# Altium project CoreHardware_2024.9.28.PrjPcb
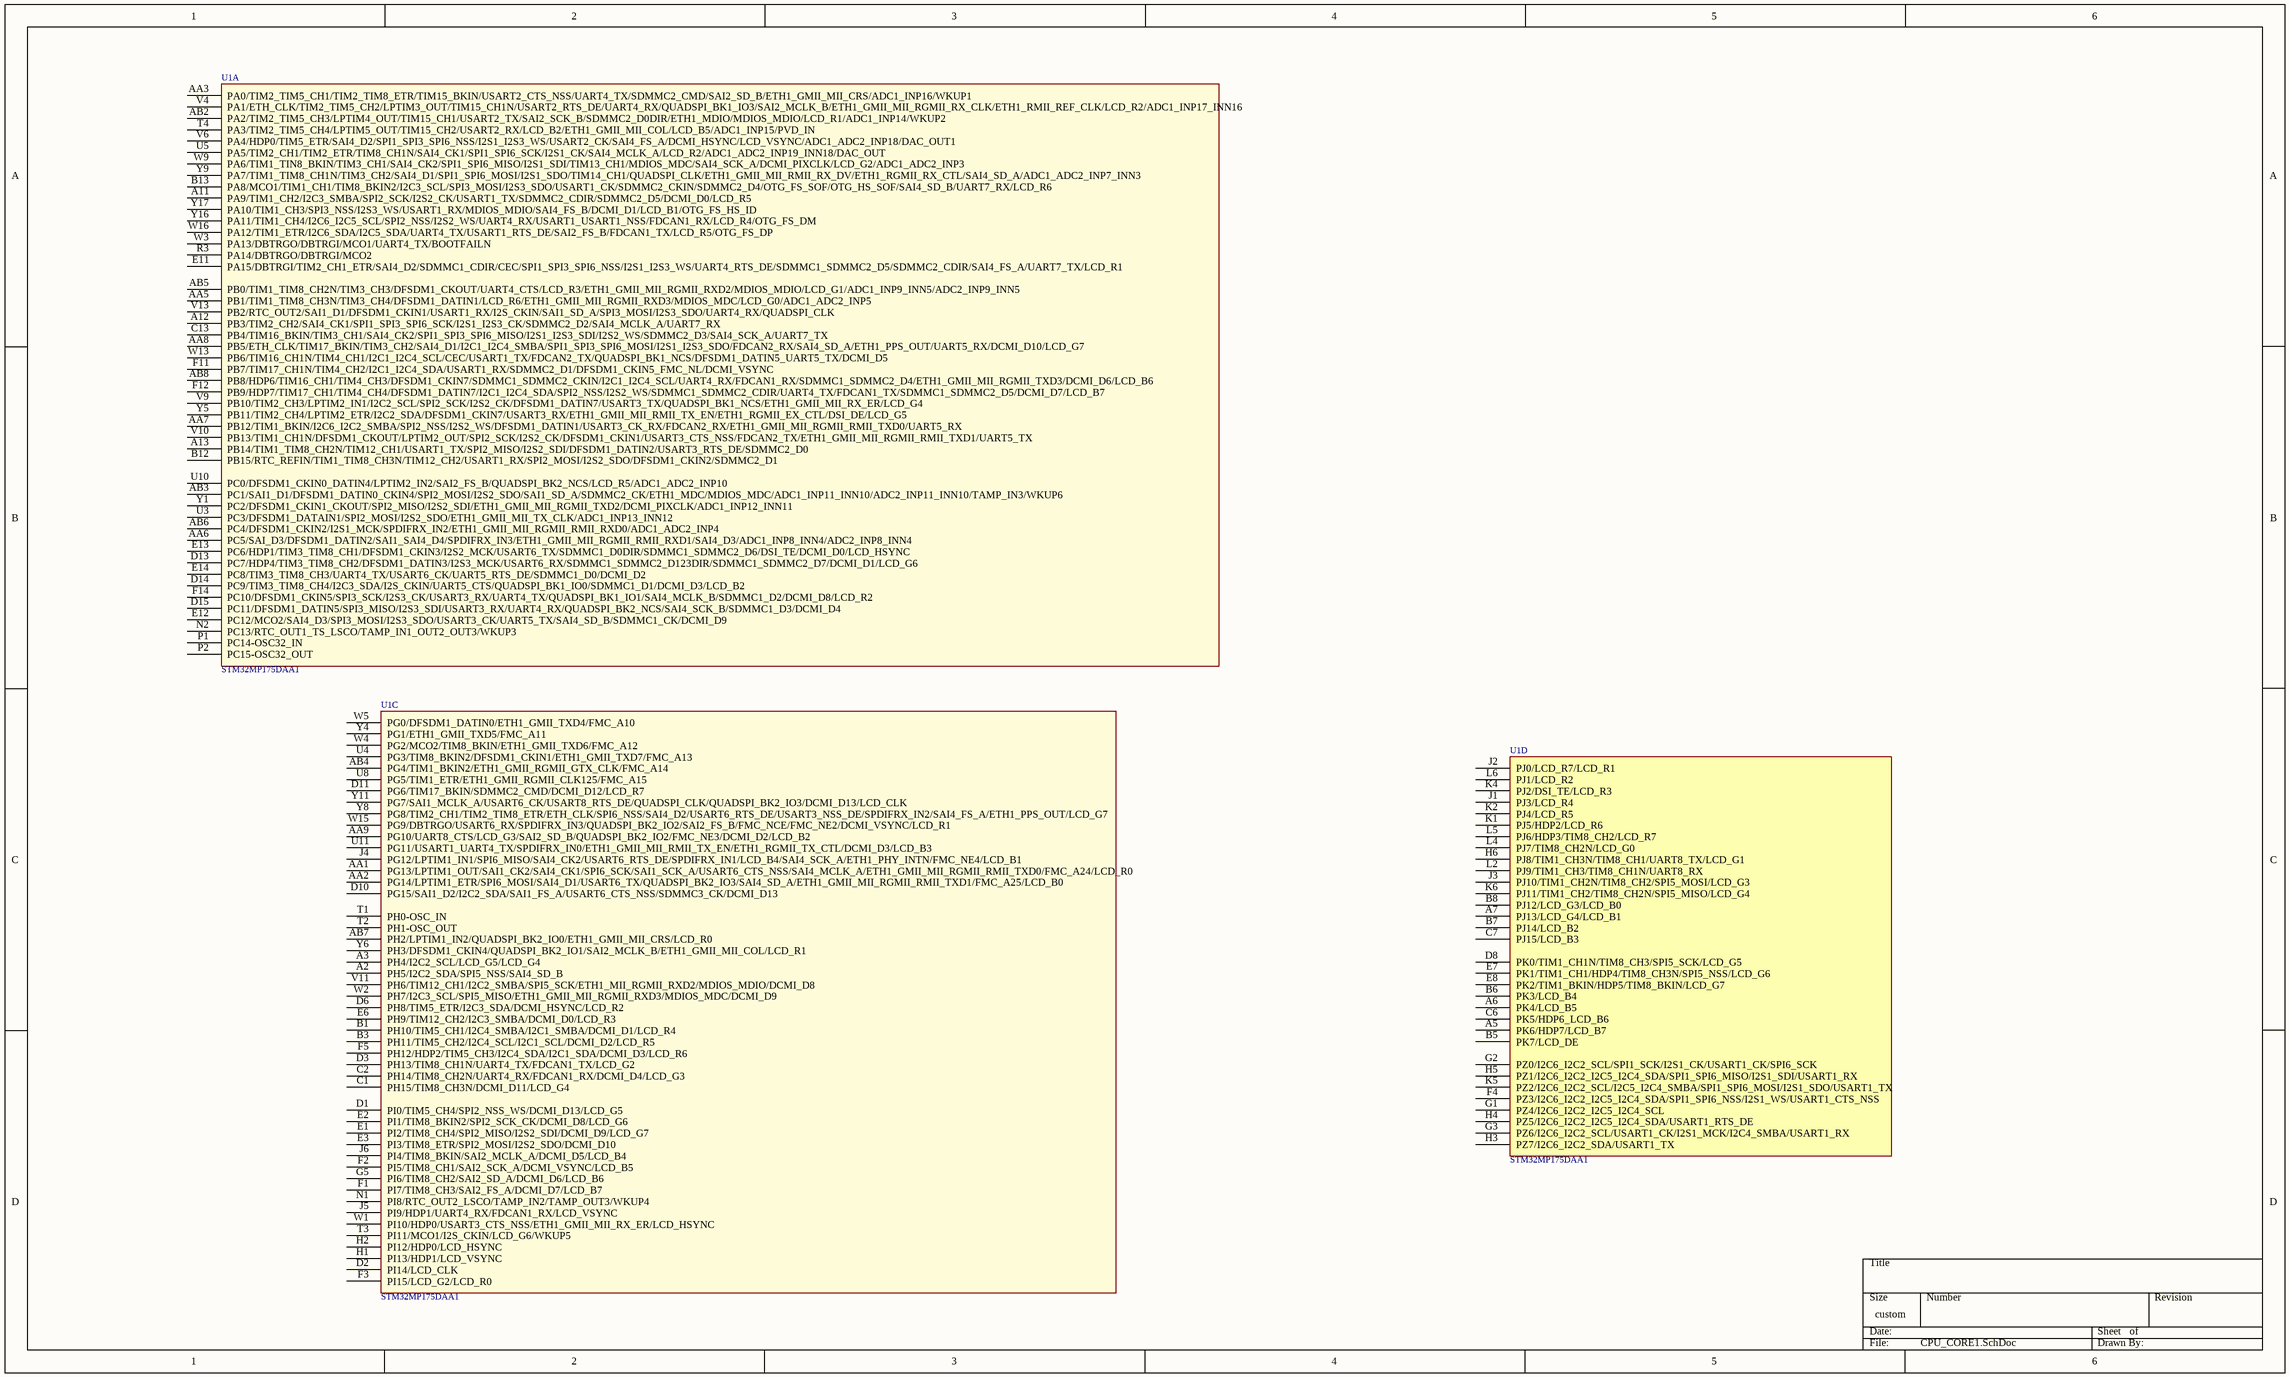
[diagram p0: CPU_CORE1.SchDoc]
9 sheets, 84 parts. Net scope: global (net labels, ports and power ports of the same name join across sheets).
Board file: CoreSTM32MP157.PcbDoc
Sheets:
  CPU_CORE1.SchDoc
  CPU_CORE2.SchDoc
  CPU_DDR.SchDoc
  CPU_POWER.SchDoc
  POWER.SchDoc
  DDR.SchDoc
  EMMC.SchDoc
  PHY.SchDoc
  BTB.SchDoc

## Sheet CPU_CORE1.SchDoc
size 508 x 304 mm; SheetNumber: 1; SheetTotal: 6

### Parts
(Parts that share a designator on the sheet are numbered #1, #2 ... from top to bottom, then left to right.)
U1#1  STM32MP175DAA1  [LFBGA448]  (parts A,C,D of 7)

### Nets

Not connected (* = marked no-connect by the designer): U1#1 A2(PH5/I2C2_SDA/SPI5_NSS/SAI4_SD_B) A3(PH4/I2C2_SCL/LCD_G5/LCD_G4) A5(PK6/HDP7/LCD_B7) A6(PK4/LCD_B5) A7(PJ13/LCD_G4/LCD_B1) A11(PA9/TIM1_CH2/I2C3_SMBA/SPI2_SCK/I2S2_CK/USART1_TX/SDMMC2_CDIR/SDMMC2_D5/DCMI_D0/LCD_R5) A12(PB3/TIM2_CH2/SAI4_CK1/SPI1_SPI3_SPI6_SCK/I2S1_I2S3_CK/SDMMC2_D2/SAI4_MCLK_A/UART7_RX) A13(PB14/TIM1_TIM8_CH2N/TIM12_CH1/USART1_TX/SPI2_MISO/I2S2_SDI/DFSDM1_DATIN2/USART3_RTS_DE/SDMMC2_D0) AA1(PG13/LPTIM1_OUT/SAI1_CK2/SAI4_CK1/SPI6_SCK/SAI1_SCK_A/USART6_CTS_NSS/SAI4_MCLK_A/ETH1_GMII_MII_RGMII_RMII_TXD0/FMC_A24/LCD_R0) AA2(PG14/LPTIM1_ETR/SPI6_MOSI/SAI4_D1/USART6_TX/QUADSPI_BK2_IO3/SAI4_SD_A/ETH1_GMII_MII_RGMII_RMII_TXD1/FMC_A25/LCD_B0) AA3(PA0/TIM2_TIM5_CH1/TIM2_TIM8_ETR/TIM15_BKIN/USART2_CTS_NSS/UART4_TX/SDMMC2_CMD/SAI2_SD_B/ETH1_GMII_MII_CRS/ADC1_INP16/WKUP1) AA5(PB1/TIM1_TIM8_CH3N/TIM3_CH4/DFSDM1_DATIN1/LCD_R6/ETH1_GMII_MII_RGMII_RXD3/MDIOS_MDC/LCD_G0/ADC1_ADC2_INP5) AA6(PC5/SAI_D3/DFSDM1_DATIN2/SAI1_SAI4_D4/SPDIFRX_IN3/ETH1_GMII_MII_RGMII_RMII_RXD1/SAI4_D3/ADC1_INP8_INN4/ADC2_INP8_INN4) AA7(PB12/TIM1_BKIN/I2C6_I2C2_SMBA/SPI2_NSS/I2S2_WS/DFSDM1_DATIN1/USART3_CK_RX/FDCAN2_RX/ETH1_GMII_MII_RGMII_RMII_TXD0/UART5_RX) AA8(PB5/ETH_CLK/TIM17_BKIN/TIM3_CH2/SAI4_D1/I2C1_I2C4_SMBA/SPI1_SPI3_SPI6_MOSI/I2S1_I2S3_SDO/FDCAN2_RX/SAI4_SD_A/ETH1_PPS_OUT/UART5_RX/DCMI_D10/LCD_G7) AA9(PG10/UART8_CTS/LCD_G3/SAI2_SD_B/QUADSPI_BK2_IO2/FMC_NE3/DCMI_D2/LCD_B2) AB2(PA2/TIM2_TIM5_CH3/LPTIM4_OUT/TIM15_CH1/USART2_TX/SAI2_SCK_B/SDMMC2_D0DIR/ETH1_MDIO/MDIOS_MDIO/LCD_R1/ADC1_INP14/WKUP2) AB3(PC1/SAI1_D1/DFSDM1_DATIN0_CKIN4/SPI2_MOSI/I2S2_SDO/SAI1_SD_A/SDMMC2_CK/ETH1_MDC/MDIOS_MDC/ADC1_INP11_INN10/ADC2_INP11_INN10/TAMP_IN3/WKUP6) AB4(PG4/TIM1_BKIN2/ETH1_GMII_RGMII_GTX_CLK/FMC_A14) AB5(PB0/TIM1_TIM8_CH2N/TIM3_CH3/DFSDM1_CKOUT/UART4_CTS/LCD_R3/ETH1_GMII_MII_RGMII_RXD2/MDIOS_MDIO/LCD_G1/ADC1_INP9_INN5/ADC2_INP9_INN5) AB6(PC4/DFSDM1_CKIN2/I2S1_MCK/SPDIFRX_IN2/ETH1_GMII_MII_RGMII_RMII_RXD0/ADC1_ADC2_INP4) AB7(PH2/LPTIM1_IN2/QUADSPI_BK2_IO0/ETH1_GMII_MII_CRS/LCD_R0) AB8(PB8/HDP6/TIM16_CH1/TIM4_CH3/DFSDM1_CKIN7/SDMMC1_SDMMC2_CKIN/I2C1_I2C4_SCL/UART4_RX/FDCAN1_RX/SDMMC1_SDMMC2_D4/ETH1_GMII_MII_RGMII_TXD3/DCMI_D6/LCD_B6) B1(PH10/TIM5_CH1/I2C4_SMBA/I2C1_SMBA/DCMI_D1/LCD_R4) B3(PH11/TIM5_CH2/I2C4_SCL/I2C1_SCL/DCMI_D2/LCD_R5) B5(PK7/LCD_DE) B6(PK3/LCD_B4) B7(PJ14/LCD_B2) B8(PJ12/LCD_G3/LCD_B0) B12(PB15/RTC_REFIN/TIM1_TIM8_CH3N/TIM12_CH2/USART1_RX/SPI2_MOSI/I2S2_SDO/DFSDM1_CKIN2/SDMMC2_D1) B13(PA8/MCO1/TIM1_CH1/TIM8_BKIN2/I2C3_SCL/SPI3_MOSI/I2S3_SDO/USART1_CK/SDMMC2_CKIN/SDMMC2_D4/OTG_FS_SOF/OTG_HS_SOF/SAI4_SD_B/UART7_RX/LCD_R6) C1(PH15/TIM8_CH3N/DCMI_D11/LCD_G4) C2(PH14/TIM8_CH2N/UART4_RX/FDCAN1_RX/DCMI_D4/LCD_G3) C6(PK5/HDP6_LCD_B6) C7(PJ15/LCD_B3) C13(PB4/TIM16_BKIN/TIM3_CH1/SAI4_CK2/SPI1_SPI3_SPI6_MISO/I2S1_I2S3_SDI/I2S2_WS/SDMMC2_D3/SAI4_SCK_A/UART7_TX) D1(PI0/TIM5_CH4/SPI2_NSS_WS/DCMI_D13/LCD_G5) D2(PI14/LCD_CLK) D3(PH13/TIM8_CH1N/UART4_TX/FDCAN1_TX/LCD_G2) D6(PH8/TIM5_ETR/I2C3_SDA/DCMI_HSYNC/LCD_R2) D8(PK0/TIM1_CH1N/TIM8_CH3/SPI5_SCK/LCD_G5) D10(PG15/SAI1_D2/I2C2_SDA/SAI1_FS_A/USART6_CTS_NSS/SDMMC3_CK/DCMI_D13) D11(PG6/TIM17_BKIN/SDMMC2_CMD/DCMI_D12/LCD_R7) D13(PC7/HDP4/TIM3_TIM8_CH2/DFSDM1_DATIN3/I2S3_MCK/USART6_RX/SDMMC1_SDMMC2_D123DIR/SDMMC1_SDMMC2_D7/DCMI_D1/LCD_G6) D14(PC9/TIM3_TIM8_CH4/I2C3_SDA/I2S_CKIN/UART5_CTS/QUADSPI_BK1_IO0/SDMMC1_D1/DCMI_D3/LCD_B2) D15(PC11/DFSDM1_DATIN5/SPI3_MISO/I2S3_SDI/USART3_RX/UART4_RX/QUADSPI_BK2_NCS/SAI4_SCK_B/SDMMC1_D3/DCMI_D4) E1(PI2/TIM8_CH4/SPI2_MISO/I2S2_SDI/DCMI_D9/LCD_G7) E2(PI1/TIM8_BKIN2/SPI2_SCK_CK/DCMI_D8/LCD_G6) E3(PI3/TIM8_ETR/SPI2_MOSI/I2S2_SDO/DCMI_D10) E6(PH9/TIM12_CH2/I2C3_SMBA/DCMI_D0/LCD_R3) E7(PK1/TIM1_CH1/HDP4/TIM8_CH3N/SPI5_NSS/LCD_G6) E8(PK2/TIM1_BKIN/HDP5/TIM8_BKIN/LCD_G7) E11(PA15/DBTRGI/TIM2_CH1_ETR/SAI4_D2/SDMMC1_CDIR/CEC/SPI1_SPI3_SPI6_NSS/I2S1_I2S3_WS/UART4_RTS_DE/SDMMC1_SDMMC2_D5/SDMMC2_CDIR/SAI4_FS_A/UART7_TX/LCD_R1) E12(PC12/MCO2/SAI4_D3/SPI3_MOSI/I2S3_SDO/USART3_CK/UART5_TX/SAI4_SD_B/SDMMC1_CK/DCMI_D9) E13(PC6/HDP1/TIM3_TIM8_CH1/DFSDM1_CKIN3/I2S2_MCK/USART6_TX/SDMMC1_D0DIR/SDMMC1_SDMMC2_D6/DSI_TE/DCMI_D0/LCD_HSYNC) E14(PC8/TIM3_TIM8_CH3/UART4_TX/USART6_CK/UART5_RTS_DE/SDMMC1_D0/DCMI_D2) F1(PI7/TIM8_CH3/SAI2_FS_A/DCMI_D7/LCD_B7) F2(PI5/TIM8_CH1/SAI2_SCK_A/DCMI_VSYNC/LCD_B5) F3(PI15/LCD_G2/LCD_R0) F4(PZ3/I2C6_I2C2_I2C5_I2C4_SDA/SPI1_SPI6_NSS/I2S1_WS/USART1_CTS_NSS) F5(PH12/HDP2/TIM5_CH3/I2C4_SDA/I2C1_SDA/DCMI_D3/LCD_R6) F11(PB7/TIM17_CH1N/TIM4_CH2/I2C1_I2C4_SDA/USART1_RX/SDMMC2_D1/DFSDM1_CKIN5_FMC_NL/DCMI_VSYNC) F12(PB9/HDP7/TIM17_CH1/TIM4_CH4/DFSDM1_DATIN7/I2C1_I2C4_SDA/SPI2_NSS/I2S2_WS/SDMMC1_SDMMC2_CDIR/UART4_TX/FDCAN1_TX/SDMMC1_SDMMC2_D5/DCMI_D7/LCD_B7) F14(PC10/DFSDM1_CKIN5/SPI3_SCK/I2S3_CK/USART3_RX/UART4_TX/QUADSPI_BK1_IO1/SAI4_MCLK_B/SDMMC1_D2/DCMI_D8/LCD_R2) G1(PZ4/I2C6_I2C2_I2C5_I2C4_SCL) G2(PZ0/I2C6_I2C2_SCL/SPI1_SCK/I2S1_CK/USART1_CK/SPI6_SCK) G3(PZ6/I2C6_I2C2_SCL/USART1_CK/I2S1_MCK/I2C4_SMBA/USART1_RX) G5(PI6/TIM8_CH2/SAI2_SD_A/DCMI_D6/LCD_B6) H1(PI13/HDP1/LCD_VSYNC) H2(PI12/HDP0/LCD_HSYNC) H3(PZ7/I2C6_I2C2_SDA/USART1_TX) H4(PZ5/I2C6_I2C2_I2C5_I2C4_SDA/USART1_RTS_DE) H5(PZ1/I2C6_I2C2_I2C5_I2C4_SDA/SPI1_SPI6_MISO/I2S1_SDI/USART1_RX) H6(PJ8/TIM1_CH3N/TIM8_CH1/UART8_TX/LCD_G1) J1(PJ3/LCD_R4) J2(PJ0/LCD_R7/LCD_R1) J3(PJ10/TIM1_CH2N/TIM8_CH2/SPI5_MOSI/LCD_G3) J4(PG12/LPTIM1_IN1/SPI6_MISO/SAI4_CK2/USART6_RTS_DE/SPDIFRX_IN1/LCD_B4/SAI4_SCK_A/ETH1_PHY_INTN/FMC_NE4/LCD_B1) J5(PI9/HDP1/UART4_RX/FDCAN1_RX/LCD_VSYNC) J6(PI4/TIM8_BKIN/SAI2_MCLK_A/DCMI_D5/LCD_B4) K1(PJ5/HDP2/LCD_R6) K2(PJ4/LCD_R5) K4(PJ2/DSI_TE/LCD_R3) K5(PZ2/I2C6_I2C2_SCL/I2C5_I2C4_SMBA/SPI1_SPI6_MOSI/I2S1_SDO/USART1_TX) K6(PJ11/TIM1_CH2/TIM8_CH2N/SPI5_MISO/LCD_G4) L2(PJ9/TIM1_CH3/TIM8_CH1N/UART8_RX) L4(PJ7/TIM8_CH2N/LCD_G0) L5(PJ6/HDP3/TIM8_CH2/LCD_R7) L6(PJ1/LCD_R2) N1(PI8/RTC_OUT2_LSCO/TAMP_IN2/TAMP_OUT3/WKUP4) N2(PC13/RTC_OUT1_TS_LSCO/TAMP_IN1_OUT2_OUT3/WKUP3) P1(PC14-OSC32_IN) P2(PC15-OSC32_OUT) R3(PA14/DBTRGO/DBTRGI/MCO2) T1(PH0-OSC_IN) T2(PH1-OSC_OUT) T3(PI11/MCO1/I2S_CKIN/LCD_G6/WKUP5) T4(PA3/TIM2_TIM5_CH4/LPTIM5_OUT/TIM15_CH2/USART2_RX/LCD_B2/ETH1_GMII_MII_COL/LCD_B5/ADC1_INP15/PVD_IN) U3(PC3/DFSDM1_DATAIN1/SPI2_MOSI/I2S2_SDO/ETH1_GMII_MII_TX_CLK/ADC1_INP13_INN12) U4(PG3/TIM8_BKIN2/DFSDM1_CKIN1/ETH1_GMII_TXD7/FMC_A13) U5(PA5/TIM2_CH1/TIM2_ETR/TIM8_CH1N/SAI4_CK1/SPI1_SPI6_SCK/I2S1_CK/SAI4_MCLK_A/LCD_R2/ADC1_ADC2_INP19_INN18/DAC_OUT) U8(PG5/TIM1_ETR/ETH1_GMII_RGMII_CLK125/FMC_A15) U10(PC0/DFSDM1_CKIN0_DATIN4/LPTIM2_IN2/SAI2_FS_B/QUADSPI_BK2_NCS/LCD_R5/ADC1_ADC2_INP10) U11(PG11/USART1_UART4_TX/SPDIFRX_IN0/ETH1_GMII_MII_RMII_TX_EN/ETH1_RGMII_TX_CTL/DCMI_D3/LCD_B3) V4(PA1/ETH_CLK/TIM2_TIM5_CH2/LPTIM3_OUT/TIM15_CH1N/USART2_RTS_DE/UART4_RX/QUADSPI_BK1_IO3/SAI2_MCLK_B/ETH1_GMII_MII_RGMII_RX_CLK/ETH1_RMII_REF_CLK/LCD_R2/ADC1_INP17_INN16) V6(PA4/HDP0/TIM5_ETR/SAI4_D2/SPI1_SPI3_SPI6_NSS/I2S1_I2S3_WS/USART2_CK/SAI4_FS_A/DCMI_HSYNC/LCD_VSYNC/ADC1_ADC2_INP18/DAC_OUT1) V9(PB10/TIM2_CH3/LPTIM2_IN1/I2C2_SCL/SPI2_SCK/I2S2_CK/DFSDM1_DATIN7/USART3_TX/QUADSPI_BK1_NCS/ETH1_GMII_MII_RX_ER/LCD_G4) V10(PB13/TIM1_CH1N/DFSDM1_CKOUT/LPTIM2_OUT/SPI2_SCK/I2S2_CK/DFSDM1_CKIN1/USART3_CTS_NSS/FDCAN2_TX/ETH1_GMII_MII_RGMII_RMII_TXD1/UART5_TX) V11(PH6/TIM12_CH1/I2C2_SMBA/SPI5_SCK/ETH1_MII_RGMII_RXD2/MDIOS_MDIO/DCMI_D8) V13(PB2/RTC_OUT2/SAI1_D1/DFSDM1_CKIN1/USART1_RX/I2S_CKIN/SAI1_SD_A/SPI3_MOSI/I2S3_SDO/UART4_RX/QUADSPI_CLK) W1(PI10/HDP0/USART3_CTS_NSS/ETH1_GMII_MII_RX_ER/LCD_HSYNC) W2(PH7/I2C3_SCL/SPI5_MISO/ETH1_GMII_MII_RGMII_RXD3/MDIOS_MDC/DCMI_D9) W3(PA13/DBTRGO/DBTRGI/MCO1/UART4_TX/BOOTFAILN) W4(PG2/MCO2/TIM8_BKIN/ETH1_GMII_TXD6/FMC_A12) W5(PG0/DFSDM1_DATIN0/ETH1_GMII_TXD4/FMC_A10) W9(PA6/TIM1_TIN8_BKIN/TIM3_CH1/SAI4_CK2/SPI1_SPI6_MISO/I2S1_SDI/TIM13_CH1/MDIOS_MDC/SAI4_SCK_A/DCMI_PIXCLK/LCD_G2/ADC1_ADC2_INP3) W13(PB6/TIM16_CH1N/TIM4_CH1/I2C1_I2C4_SCL/CEC/USART1_TX/FDCAN2_TX/QUADSPI_BK1_NCS/DFSDM1_DATIN5_UART5_TX/DCMI_D5) W15(PG9/DBTRGO/USART6_RX/SPDIFRX_IN3/QUADSPI_BK2_IO2/SAI2_FS_B/FMC_NCE/FMC_NE2/DCMI_VSYNC/LCD_R1) W16(PA12/TIM1_ETR/I2C6_SDA/I2C5_SDA/UART4_TX/USART1_RTS_DE/SAI2_FS_B/FDCAN1_TX/LCD_R5/OTG_FS_DP) Y1(PC2/DFSDM1_CKIN1_CKOUT/SPI2_MISO/I2S2_SDI/ETH1_GMII_MII_RGMII_TXD2/DCMI_PIXCLK/ADC1_INP12_INN11) Y4(PG1/ETH1_GMII_TXD5/FMC_A11) Y5(PB11/TIM2_CH4/LPTIM2_ETR/I2C2_SDA/DFSDM1_CKIN7/USART3_RX/ETH1_GMII_MII_RMII_TX_EN/ETH1_RGMII_EX_CTL/DSI_DE/LCD_G5) Y6(PH3/DFSDM1_CKIN4/QUADSPI_BK2_IO1/SAI2_MCLK_B/ETH1_GMII_MII_COL/LCD_R1) Y8(PG8/TIM2_CH1/TIM2_TIM8_ETR/ETH_CLK/SPI6_NSS/SAI4_D2/USART6_RTS_DE/USART3_NSS_DE/SPDIFRX_IN2/SAI4_FS_A/ETH1_PPS_OUT/LCD_G7) Y9(PA7/TIM1_TIM8_CH1N/TIM3_CH2/SAI4_D1/SPI1_SPI6_MOSI/I2S1_SDO/TIM14_CH1/QUADSPI_CLK/ETH1_GMII_MII_RMII_RX_DV/ETH1_RGMII_RX_CTL/SAI4_SD_A/ADC1_ADC2_INP7_INN3) Y11(PG7/SAI1_MCLK_A/USART6_CK/USART8_RTS_DE/QUADSPI_CLK/QUADSPI_BK2_IO3/DCMI_D13/LCD_CLK) Y16(PA11/TIM1_CH4/I2C6_I2C5_SCL/SPI2_NSS/I2S2_WS/UART4_RX/USART1_USART1_NSS/FDCAN1_RX/LCD_R4/OTG_FS_DM) Y17(PA10/TIM1_CH3/SPI3_NSS/I2S3_WS/USART1_RX/MDIOS_MDIO/SAI4_FS_B/DCMI_D1/LCD_B1/OTG_FS_HS_ID)

### Library data of the parts
U1#1 = STM32MP175AAA3

## Sheet CPU_CORE2.SchDoc
size A3; SheetNumber: 2; SheetTotal: 6
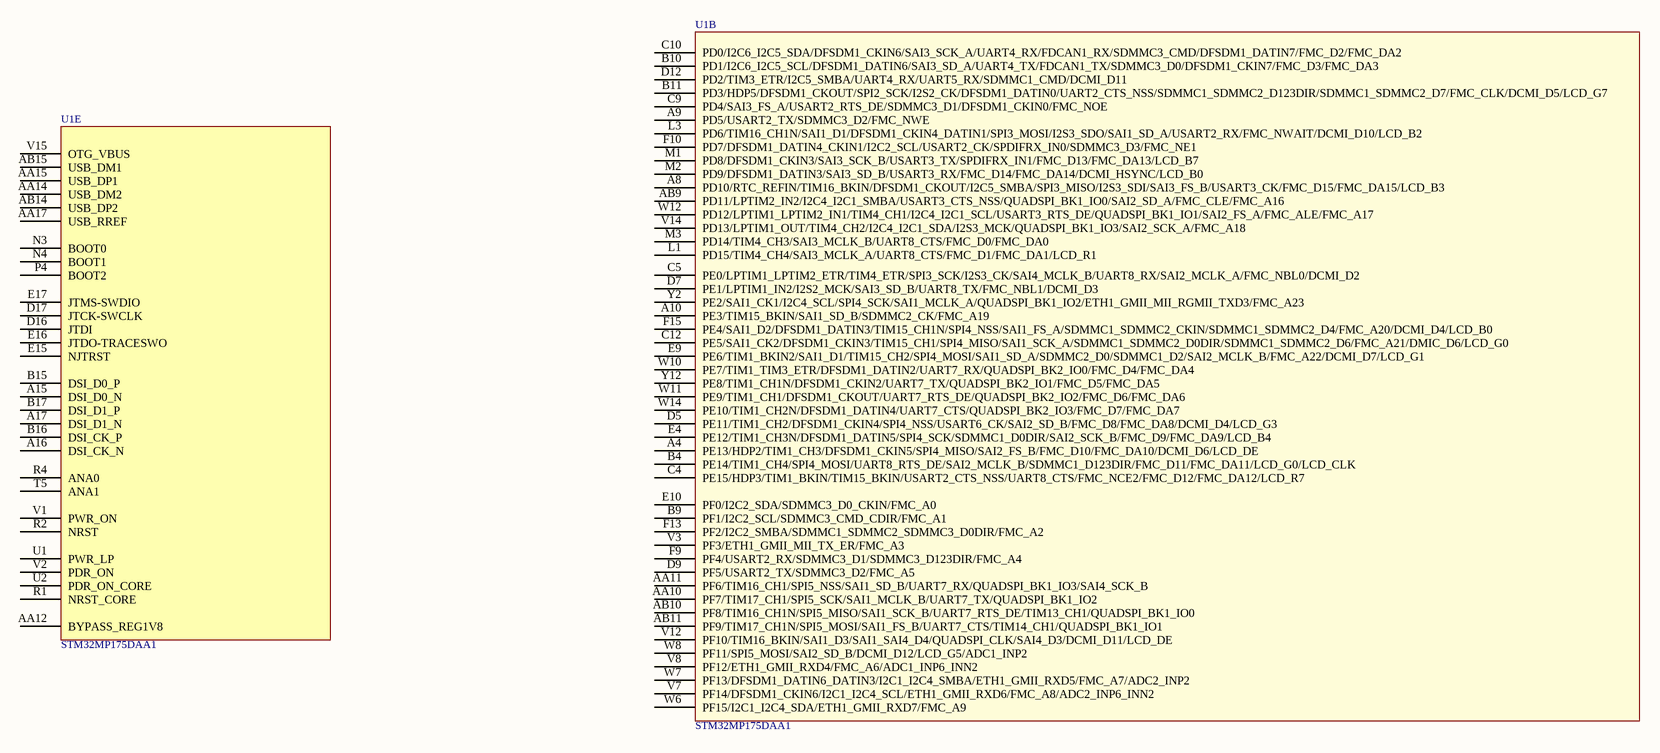
[diagram p1: CPU_CORE2.SchDoc]

### Parts
(Parts that share a designator on the sheet are numbered #1, #2 ... from top to bottom, then left to right.)
U1#1  STM32MP175DAA1  [LFBGA448]  (parts B,E of 7)

### Nets

Not connected (* = marked no-connect by the designer): U1#1 A4(PE13/HDP2/TIM1_CH3/DFSDM1_CKIN5/SPI4_MISO/SAI2_FS_B/FMC_D10/FMC_DA10/DCMI_D6/LCD_DE) A8(PD10/RTC_REFIN/TIM16_BKIN/DFSDM1_CKOUT/I2C5_SMBA/SPI3_MISO/I2S3_SDI/SAI3_FS_B/USART3_CK/FMC_D15/FMC_DA15/LCD_B3) A9(PD5/USART2_TX/SDMMC3_D2/FMC_NWE) A10(PE3/TIM15_BKIN/SAI1_SD_B/SDMMC2_CK/FMC_A19) A15(DSI_D0_N) A16(DSI_CK_N) A17(DSI_D1_N) AA10(PF7/TIM17_CH1/SPI5_SCK/SAI1_MCLK_B/UART7_TX/QUADSPI_BK1_IO2) AA11(PF6/TIM16_CH1/SPI5_NSS/SAI1_SD_B/UART7_RX/QUADSPI_BK1_IO3/SAI4_SCK_B) AA12(BYPASS_REG1V8) AA14(USB_DM2) AA15(USB_DP1) AA17(USB_RREF) AB9(PD11/LPTIM2_IN2/I2C4_I2C1_SMBA/USART3_CTS_NSS/QUADSPI_BK1_IO0/SAI2_SD_A/FMC_CLE/FMC_A16) AB10(PF8/TIM16_CH1N/SPI5_MISO/SAI1_SCK_B/UART7_RTS_DE/TIM13_CH1/QUADSPI_BK1_IO0) AB11(PF9/TIM17_CH1N/SPI5_MOSI/SAI1_FS_B/UART7_CTS/TIM14_CH1/QUADSPI_BK1_IO1) AB14(USB_DP2) AB15(USB_DM1) B4(PE14/TIM1_CH4/SPI4_MOSI/UART8_RTS_DE/SAI2_MCLK_B/SDMMC1_D123DIR/FMC_D11/FMC_DA11/LCD_G0/LCD_CLK) B9(PF1/I2C2_SCL/SDMMC3_CMD_CDIR/FMC_A1) B10(PD1/I2C6_I2C5_SCL/DFSDM1_DATIN6/SAI3_SD_A/UART4_TX/FDCAN1_TX/SDMMC3_D0/DFSDM1_CKIN7/FMC_D3/FMC_DA3) B11(PD3/HDP5/DFSDM1_CKOUT/SPI2_SCK/I2S2_CK/DFSDM1_DATIN0/UART2_CTS_NSS/SDMMC1_SDMMC2_D123DIR/SDMMC1_SDMMC2_D7/FMC_CLK/DCMI_D5/LCD_G7) B15(DSI_D0_P) B16(DSI_CK_P) B17(DSI_D1_P) C4(PE15/HDP3/TIM1_BKIN/TIM15_BKIN/USART2_CTS_NSS/UART8_CTS/FMC_NCE2/FMC_D12/FMC_DA12/LCD_R7) C5(PE0/LPTIM1_LPTIM2_ETR/TIM4_ETR/SPI3_SCK/I2S3_CK/SAI4_MCLK_B/UART8_RX/SAI2_MCLK_A/FMC_NBL0/DCMI_D2) C9(PD4/SAI3_FS_A/USART2_RTS_DE/SDMMC3_D1/DFSDM1_CKIN0/FMC_NOE) C10(PD0/I2C6_I2C5_SDA/DFSDM1_CKIN6/SAI3_SCK_A/UART4_RX/FDCAN1_RX/SDMMC3_CMD/DFSDM1_DATIN7/FMC_D2/FMC_DA2) C12(PE5/SAI1_CK2/DFSDM1_CKIN3/TIM15_CH1/SPI4_MISO/SAI1_SCK_A/SDMMC1_SDMMC2_D0DIR/SDMMC1_SDMMC2_D6/FMC_A21/DMIC_D6/LCD_G0) D5(PE11/TIM1_CH2/DFSDM1_CKIN4/SPI4_NSS/USART6_CK/SAI2_SD_B/FMC_D8/FMC_DA8/DCMI_D4/LCD_G3) D7(PE1/LPTIM1_IN2/I2S2_MCK/SAI3_SD_B/UART8_TX/FMC_NBL1/DCMI_D3) D9(PF5/USART2_TX/SDMMC3_D2/FMC_A5) D12(PD2/TIM3_ETR/I2C5_SMBA/UART4_RX/UART5_RX/SDMMC1_CMD/DCMI_D11) D16(JTDI) D17(JTCK-SWCLK) E4(PE12/TIM1_CH3N/DFSDM1_DATIN5/SPI4_SCK/SDMMC1_D0DIR/SAI2_SCK_B/FMC_D9/FMC_DA9/LCD_B4) E9(PE6/TIM1_BKIN2/SAI1_D1/TIM15_CH2/SPI4_MOSI/SAI1_SD_A/SDMMC2_D0/SDMMC1_D2/SAI2_MCLK_B/FMC_A22/DCMI_D7/LCD_G1) E10(PF0/I2C2_SDA/SDMMC3_D0_CKIN/FMC_A0) E15(NJTRST) E16(JTDO-TRACESWO) E17(JTMS-SWDIO) F9(PF4/USART2_RX/SDMMC3_D1/SDMMC3_D123DIR/FMC_A4) F10(PD7/DFSDM1_DATIN4_CKIN1/I2C2_SCL/USART2_CK/SPDIFRX_IN0/SDMMC3_D3/FMC_NE1) F13(PF2/I2C2_SMBA/SDMMC1_SDMMC2_SDMMC3_D0DIR/FMC_A2) F15(PE4/SAI1_D2/DFSDM1_DATIN3/TIM15_CH1N/SPI4_NSS/SAI1_FS_A/SDMMC1_SDMMC2_CKIN/SDMMC1_SDMMC2_D4/FMC_A20/DCMI_D4/LCD_B0) L1(PD15/TIM4_CH4/SAI3_MCLK_A/UART8_CTS/FMC_D1/FMC_DA1/LCD_R1) L3(PD6/TIM16_CH1N/SAI1_D1/DFSDM1_CKIN4_DATIN1/SPI3_MOSI/I2S3_SDO/SAI1_SD_A/USART2_RX/FMC_NWAIT/DCMI_D10/LCD_B2) M1(PD8/DFSDM1_CKIN3/SAI3_SCK_B/USART3_TX/SPDIFRX_IN1/FMC_D13/FMC_DA13/LCD_B7) M2(PD9/DFSDM1_DATIN3/SAI3_SD_B/USART3_RX/FMC_D14/FMC_DA14/DCMI_HSYNC/LCD_B0) M3(PD14/TIM4_CH3/SAI3_MCLK_B/UART8_CTS/FMC_D0/FMC_DA0) N3(BOOT0) N4(BOOT1) P4(BOOT2) R1(NRST_CORE) R2(NRST) R4(ANA0) T5(ANA1) U1(PWR_LP) U2(PDR_ON_CORE) V1(PWR_ON) V2(PDR_ON) V3(PF3/ETH1_GMII_MII_TX_ER/FMC_A3) V7(PF14/DFSDM1_CKIN6/I2C1_I2C4_SCL/ETH1_GMII_RXD6/FMC_A8/ADC2_INP6_INN2) V8(PF12/ETH1_GMII_RXD4/FMC_A6/ADC1_INP6_INN2) V12(PF10/TIM16_BKIN/SAI1_D3/SAI1_SAI4_D4/QUADSPI_CLK/SAI4_D3/DCMI_D11/LCD_DE) V14(PD13/LPTIM1_OUT/TIM4_CH2/I2C4_I2C1_SDA/I2S3_MCK/QUADSPI_BK1_IO3/SAI2_SCK_A/FMC_A18) V15(OTG_VBUS) W6(PF15/I2C1_I2C4_SDA/ETH1_GMII_RXD7/FMC_A9) W7(PF13/DFSDM1_DATIN6_DATIN3/I2C1_I2C4_SMBA/ETH1_GMII_RXD5/FMC_A7/ADC2_INP2) W8(PF11/SPI5_MOSI/SAI2_SD_B/DCMI_D12/LCD_G5/ADC1_INP2) W10(PE7/TIM1_TIM3_ETR/DFSDM1_DATIN2/UART7_RX/QUADSPI_BK2_IO0/FMC_D4/FMC_DA4) W11(PE9/TIM1_CH1/DFSDM1_CKOUT/UART7_RTS_DE/QUADSPI_BK2_IO2/FMC_D6/FMC_DA6) W12(PD12/LPTIM1_LPTIM2_IN1/TIM4_CH1/I2C4_I2C1_SCL/USART3_RTS_DE/QUADSPI_BK1_IO1/SAI2_FS_A/FMC_ALE/FMC_A17) W14(PE10/TIM1_CH2N/DFSDM1_DATIN4/UART7_CTS/QUADSPI_BK2_IO3/FMC_D7/FMC_DA7) Y2(PE2/SAI1_CK1/I2C4_SCL/SPI4_SCK/SAI1_MCLK_A/QUADSPI_BK1_IO2/ETH1_GMII_MII_RGMII_TXD3/FMC_A23) Y12(PE8/TIM1_CH1N/DFSDM1_CKIN2/UART7_TX/QUADSPI_BK2_IO1/FMC_D5/FMC_DA5)

### Library data of the parts
U1#1 = STM32MP175AAA3

## Sheet CPU_DDR.SchDoc
size A4; SheetNumber: 3; SheetTotal: 6
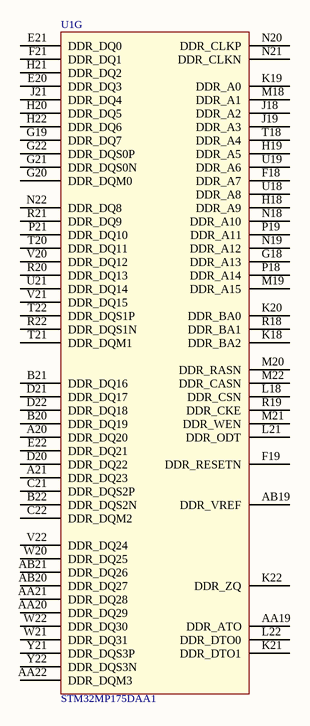
[diagram p2: CPU_DDR.SchDoc]

### Parts
(Parts that share a designator on the sheet are numbered #1, #2 ... from top to bottom, then left to right.)
U1#1  STM32MP175DAA1  [LFBGA448]  (part G of 7)

### Nets

Not connected (* = marked no-connect by the designer): U1#1 A20(DDR_DQ20) A21(DDR_DQ23) AA19(DDR_ATO) AA20(DDR_DQ29) AA21(DDR_DQ28) AA22(DDR_DQM3) AB19(DDR_VREF) AB20(DDR_DQ27) AB21(DDR_DQ26) B20(DDR_DQ19) B21(DDR_DQ16) B22(DDR_DQS2N) C21(DDR_DQS2P) C22(DDR_DQM2) D20(DDR_DQ22) D21(DDR_DQ17) D22(DDR_DQ18) E20(DDR_DQ3) E21(DDR_DQ0) E22(DDR_DQ21) F18(DDR_A7) F19(DDR_RESETN) F21(DDR_DQ1) G18(DDR_A13) G19(DDR_DQ7) G20(DDR_DQM0) G21(DDR_DQS0N) G22(DDR_DQS0P) H18(DDR_A9) H19(DDR_A5) H20(DDR_DQ5) H21(DDR_DQ2) H22(DDR_DQ6) J18(DDR_A2) J19(DDR_A3) J21(DDR_DQ4) K18(DDR_BA2) K19(DDR_A0) K20(DDR_BA0) K21(DDR_DTO1) K22(DDR_ZQ) L18(DDR_CSN) L21(DDR_ODT) L22(DDR_DTO0) M18(DDR_A1) M19(DDR_A15) M20(DDR_RASN) M21(DDR_WEN) M22(DDR_CASN) N18(DDR_A10) N19(DDR_A12) N20(DDR_CLKP) N21(DDR_CLKN) N22(DDR_DQ8) P18(DDR_A14) P19(DDR_A11) P21(DDR_DQ10) R18(DDR_BA1) R19(DDR_CKE) R20(DDR_DQ13) R21(DDR_DQ9) R22(DDR_DQS1N) T18(DDR_A4) T20(DDR_DQ11) T21(DDR_DQM1) T22(DDR_DQS1P) U18(DDR_A8) U19(DDR_A6) U21(DDR_DQ14) V20(DDR_DQ12) V21(DDR_DQ15) V22(DDR_DQ24) W20(DDR_DQ25) W21(DDR_DQ31) W22(DDR_DQ30) Y21(DDR_DQS3P) Y22(DDR_DQS3N)

### Library data of the parts
U1#1 = STM32MP175AAA3

## Sheet CPU_POWER.SchDoc
size A3; SheetNumber: 4; SheetTotal: 9
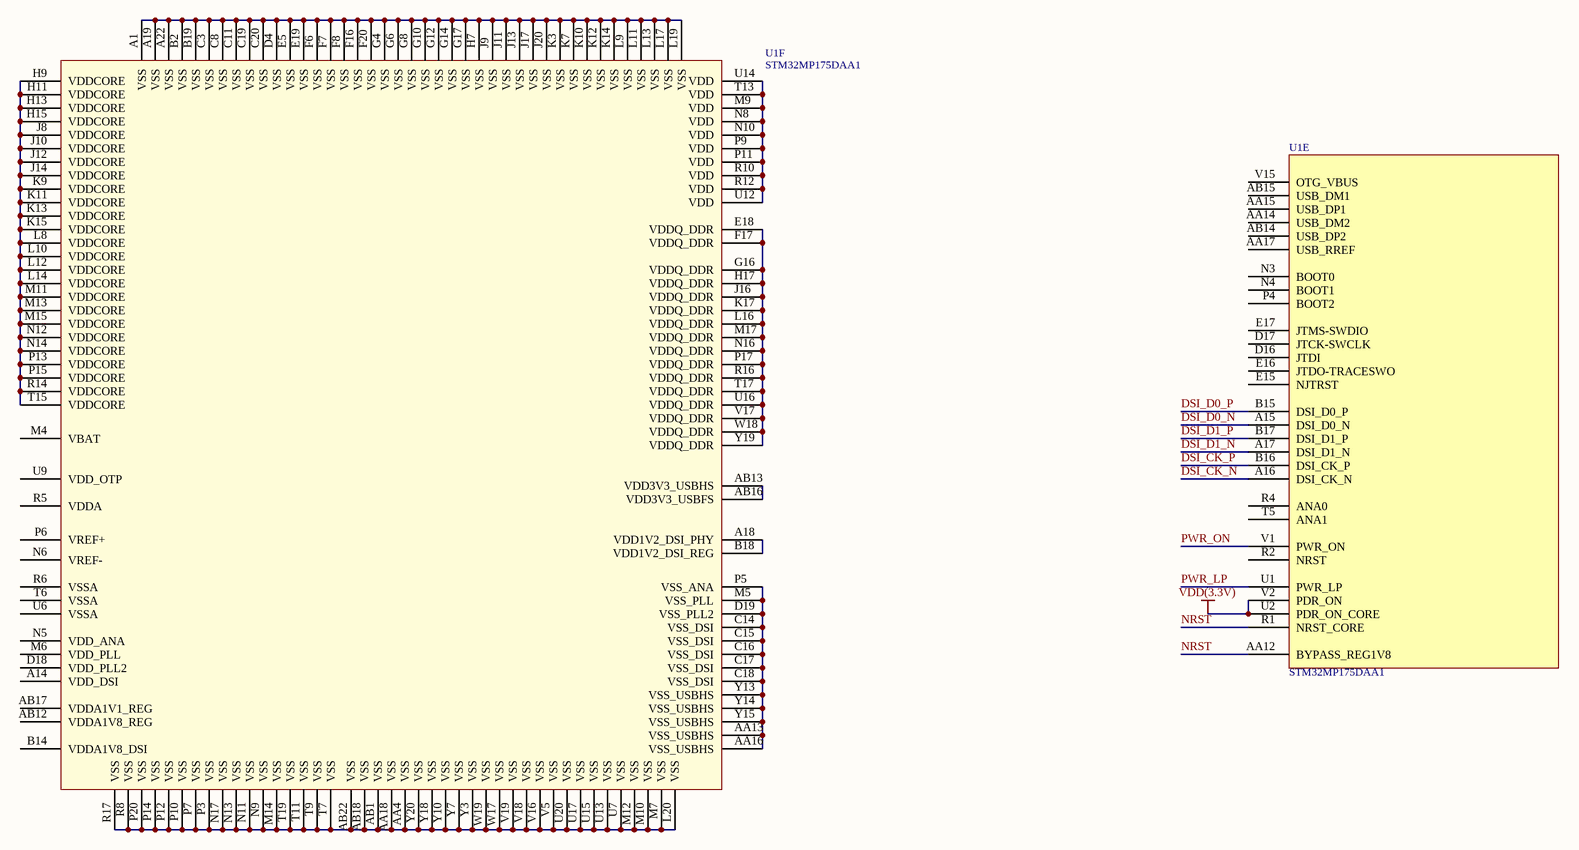
[diagram p3: CPU_POWER.SchDoc]

### Parts
(Parts that share a designator on the sheet are numbered #1, #2 ... from top to bottom, then left to right.)
U1#1  STM32MP175DAA1  [LFBGA448]  (part F of 7)
U1#2  STM32MP175DAA1  [LFBGA448]  (part E of 7)

### Nets
VDD(3.3V): U1#2.U2(PDR_ON_CORE) U1#2.V2(PDR_ON)
DSI_CK_N: U1#2.A16(DSI_CK_N)
DSI_CK_P: U1#2.B16(DSI_CK_P)
DSI_D0_N: U1#2.A15(DSI_D0_N)
DSI_D0_P: U1#2.B15(DSI_D0_P)
DSI_D1_N: U1#2.A17(DSI_D1_N)
DSI_D1_P: U1#2.B17(DSI_D1_P)
NRST: U1#2.AA12(BYPASS_REG1V8) U1#2.R1(NRST_CORE)
PWR_LP: U1#2.U1(PWR_LP)
PWR_ON: U1#2.V1(PWR_ON)
NetU1#1_A1: U1#1.A1(VSS) U1#1.A19(VSS) U1#1.A22(VSS) U1#1.B2(VSS) U1#1.B19(VSS) U1#1.C3(VSS) U1#1.C8(VSS) U1#1.C11(VSS) U1#1.C19(VSS) U1#1.C20(VSS) U1#1.D4(VSS) U1#1.E5(VSS) U1#1.E19(VSS) U1#1.F6(VSS) U1#1.F7(VSS) U1#1.F8(VSS) U1#1.F16(VSS) U1#1.F20(VSS) U1#1.G4(VSS) U1#1.G6(VSS) U1#1.G8(VSS) U1#1.G10(VSS) U1#1.G12(VSS) U1#1.G14(VSS) U1#1.G17(VSS) U1#1.H7(VSS) U1#1.J9(VSS) U1#1.J11(VSS) U1#1.J13(VSS) U1#1.J17(VSS) U1#1.J20(VSS) U1#1.K3(VSS) U1#1.K7(VSS) U1#1.K10(VSS) U1#1.K12(VSS) U1#1.K14(VSS) U1#1.L9(VSS) U1#1.L11(VSS) U1#1.L13(VSS) U1#1.L17(VSS) U1#1.L19(VSS)
NetU1#1_A18: U1#1.A18(VDD1V2_DSI_PHY) U1#1.B18(VDD1V2_DSI_REG)
NetU1#1_AA4: U1#1.AA4(VSS) U1#1.AA18(VSS) U1#1.AB1(VSS) U1#1.AB18(VSS) U1#1.AB22(VSS) U1#1.L20(VSS) U1#1.M7(VSS) U1#1.M10(VSS) U1#1.M12(VSS) U1#1.M14(VSS) U1#1.N9(VSS) U1#1.N11(VSS) U1#1.N13(VSS) U1#1.N17(VSS) U1#1.P3(VSS) U1#1.P7(VSS) U1#1.P10(VSS) U1#1.P12(VSS) U1#1.P14(VSS) U1#1.P20(VSS) U1#1.R8(VSS) U1#1.R17(VSS) U1#1.T7(VSS) U1#1.T9(VSS) U1#1.T11(VSS) U1#1.T19(VSS) U1#1.U7(VSS) U1#1.U13(VSS) U1#1.U15(VSS) U1#1.U17(VSS) U1#1.U20(VSS) U1#1.V5(VSS) U1#1.V16(VSS) U1#1.V18(VSS) U1#1.V19(VSS) U1#1.W17(VSS) U1#1.W19(VSS) U1#1.Y3(VSS) U1#1.Y7(VSS) U1#1.Y10(VSS) U1#1.Y18(VSS) U1#1.Y20(VSS)
NetU1#1_AA13: U1#1.AA13(VSS_USBHS) U1#1.AA16(VSS_USBHS) U1#1.C14(VSS_DSI) U1#1.C15(VSS_DSI) U1#1.C16(VSS_DSI) U1#1.C17(VSS_DSI) U1#1.C18(VSS_DSI) U1#1.D19(VSS_PLL2) U1#1.M5(VSS_PLL) U1#1.P5(VSS_ANA) U1#1.Y13(VSS_USBHS) U1#1.Y14(VSS_USBHS) U1#1.Y15(VSS_USBHS)
NetU1#1_AB13: U1#1.AB13(VDD3V3_USBHS) U1#1.AB16(VDD3V3_USBFS)
NetU1#1_E18: U1#1.E18(VDDQ_DDR) U1#1.F17(VDDQ_DDR) U1#1.G16(VDDQ_DDR) U1#1.H17(VDDQ_DDR) U1#1.J16(VDDQ_DDR) U1#1.K17(VDDQ_DDR) U1#1.L16(VDDQ_DDR) U1#1.M17(VDDQ_DDR) U1#1.N16(VDDQ_DDR) U1#1.P17(VDDQ_DDR) U1#1.R16(VDDQ_DDR) U1#1.T17(VDDQ_DDR) U1#1.U16(VDDQ_DDR) U1#1.V17(VDDQ_DDR) U1#1.W18(VDDQ_DDR) U1#1.Y19(VDDQ_DDR)
NetU1#1_H9: U1#1.H9(VDDCORE) U1#1.H11(VDDCORE) U1#1.H13(VDDCORE) U1#1.H15(VDDCORE) U1#1.J8(VDDCORE) U1#1.J10(VDDCORE) U1#1.J12(VDDCORE) U1#1.J14(VDDCORE) U1#1.K9(VDDCORE) U1#1.K11(VDDCORE) U1#1.K13(VDDCORE) U1#1.K15(VDDCORE) U1#1.L8(VDDCORE) U1#1.L10(VDDCORE) U1#1.L12(VDDCORE) U1#1.L14(VDDCORE) U1#1.M11(VDDCORE) U1#1.M13(VDDCORE) U1#1.M15(VDDCORE) U1#1.N12(VDDCORE) U1#1.N14(VDDCORE) U1#1.P13(VDDCORE) U1#1.P15(VDDCORE) U1#1.R14(VDDCORE) U1#1.T15(VDDCORE)
NetU1#1_M9: U1#1.M9(VDD) U1#1.N8(VDD) U1#1.N10(VDD) U1#1.P9(VDD) U1#1.P11(VDD) U1#1.R10(VDD) U1#1.R12(VDD) U1#1.T13(VDD) U1#1.U12(VDD) U1#1.U14(VDD)

Not connected (* = marked no-connect by the designer): U1#1 A14(VDD_DSI) AB12(VDDA1V8_REG) AB17(VDDA1V1_REG) B14(VDDA1V8_DSI) D18(VDD_PLL2) M4(VBAT) M6(VDD_PLL) N5(VDD_ANA) N6(VREF-) P6(VREF+) R5(VDDA) R6(VSSA) T6(VSSA) U6(VSSA) U9(VDD_OTP); U1#2 AA14(USB_DM2) AA15(USB_DP1) AA17(USB_RREF) AB14(USB_DP2) AB15(USB_DM1) D16(JTDI) D17(JTCK-SWCLK) E15(NJTRST) E16(JTDO-TRACESWO) E17(JTMS-SWDIO) N3(BOOT0) N4(BOOT1) P4(BOOT2) R2(NRST) R4(ANA0) T5(ANA1) V15(OTG_VBUS)

### Library data of the parts
U1#1 U1#2 = STM32MP175AAA3

## Sheet POWER.SchDoc
size A4; SheetNumber: 5; SheetTotal: 8
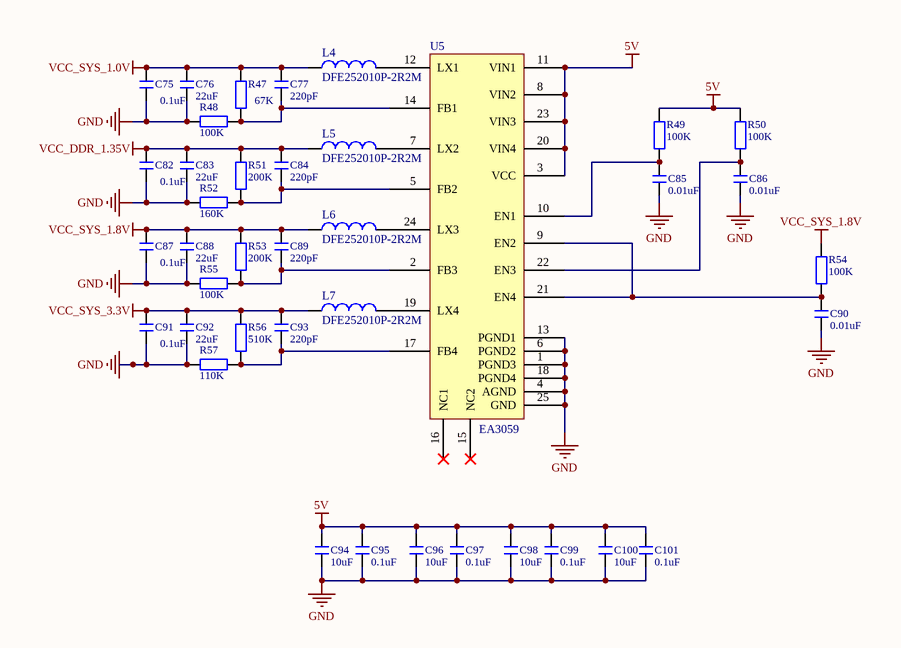
[diagram p4: POWER.SchDoc]

### Parts
C75  0.1uF  [C 0402]
C76  22uF  [C 0603]
C77  220pF  [C 0402]
C82  0.1uF  [C 0402]
C83  22uF  [C 0603]
C84  220pF  [C 0402]
C85  0.01uF  [C 0402]
C86  0.01uF  [C 0402]
C87  0.1uF  [C 0402]
C88  22uF  [C 0603]
C89  220pF  [C 0402]
C90  0.01uF  [C 0402]
C91  0.1uF  [C 0402]
C92  22uF  [C 0603]
C93  220pF  [C 0402]
C94  10uF  [C 0603]
C95  0.1uF  [C 0402]
C96  10uF  [C 0603]
C97  0.1uF  [C 0402]
C98  10uF  [C 0603]
C99  0.1uF  [C 0402]
C100  10uF  [C 0603]
C101  0.1uF  [C 0402]
L4  DFE252010P-2R2M  [L2520]
L5  DFE252010P-2R2M  [L2520]
L6  DFE252010P-2R2M  [L2520]
L7  DFE252010P-2R2M  [L2520]
R47  67K  [R 0402]
R48  100K  [R 0402]
R49  100K  [R 0402]
R50  100K  [R 0402]
R51  200K  [R 0402]
R52  160K  [R 0402]
R53  200K  [R 0402]
R54  100K  [R 0402]
R55  100K  [R 0402]
R56  510K  [R 0402]
R57  110K  [R 0402]
U5  EA3059  [VQFN-24_L4.0-W4.0-P0.50-TL-EP2.5]

### Nets
5V: C94.1 C95.1 C96.1 C97.1 C98.1 C99.1 C100.1 C101.1 R49.2 R50.2 U5.3(VCC) U5.8(VIN2) U5.11(VIN1) U5.20(VIN4) U5.23(VIN3)
GND: C75.1 C76.1 C82.1 C83.1 C85.1 C86.2 C87.1 C88.1 C90.2 C91.1 C92.1 C94.2 C95.2 C96.2 C97.2 C98.2 C99.2 C100.2 C101.2 R48.2 R52.2 R55.2 R57.2 U5.1(PGND3) U5.4(AGND) U5.6(PGND2) U5.13(PGND1) U5.18(PGND4) U5.25(GND)
VCC_DDR_1.35V: C82.2 C83.2 C84.2 L5.1 R51.2
VCC_SYS_1.0V: C75.2 C76.2 C77.2 L4.1 R47.2
VCC_SYS_1.8V: C87.2 C88.2 C89.2 L6.1 R53.2 R54.2
VCC_SYS_3.3V: C91.2 C92.2 C93.2 L7.1 R56.2
NetC77_1: C77.1 R47.1 R48.1 U5.14(FB1)
NetC84_1: C84.1 R51.1 R52.1 U5.5(FB2)
NetC85_2: C85.2 R49.1 U5.10(EN1)
NetC86_1: C86.1 R50.1 U5.22(EN3)
NetC89_1: C89.1 R53.1 R55.1 U5.2(FB3)
NetC90_1: C90.1 R54.1 U5.9(EN2) U5.21(EN4)
NetC93_1: C93.1 R56.1 R57.1 U5.17(FB4)
NetL4_2: L4.2 U5.12(LX1)
NetL5_2: L5.2 U5.7(LX2)
NetL6_2: L6.2 U5.24(LX3)
NetL7_2: L7.2 U5.19(LX4)

Not connected (* = marked no-connect by the designer): U5 15(NC2)* 16(NC1)*

### Library data of the parts
C75-C77 C82-C101 = C: 无极性贴片电容; 版权归属: 正点原子; BOM名称: 无极性贴片电容; 学习资源: www.openedv.com
L4-L7 = DFE252010P-2R2M: 电感
R47-R57 = R: 贴片电阻; 版权归属: 正点原子; BOM名称: 贴片电阻; 学习资源: www.openedv.com
U5 = EA3059: 四路电源管理

## Sheet DDR.SchDoc
size A3; SheetNumber: 6; SheetTotal: 8
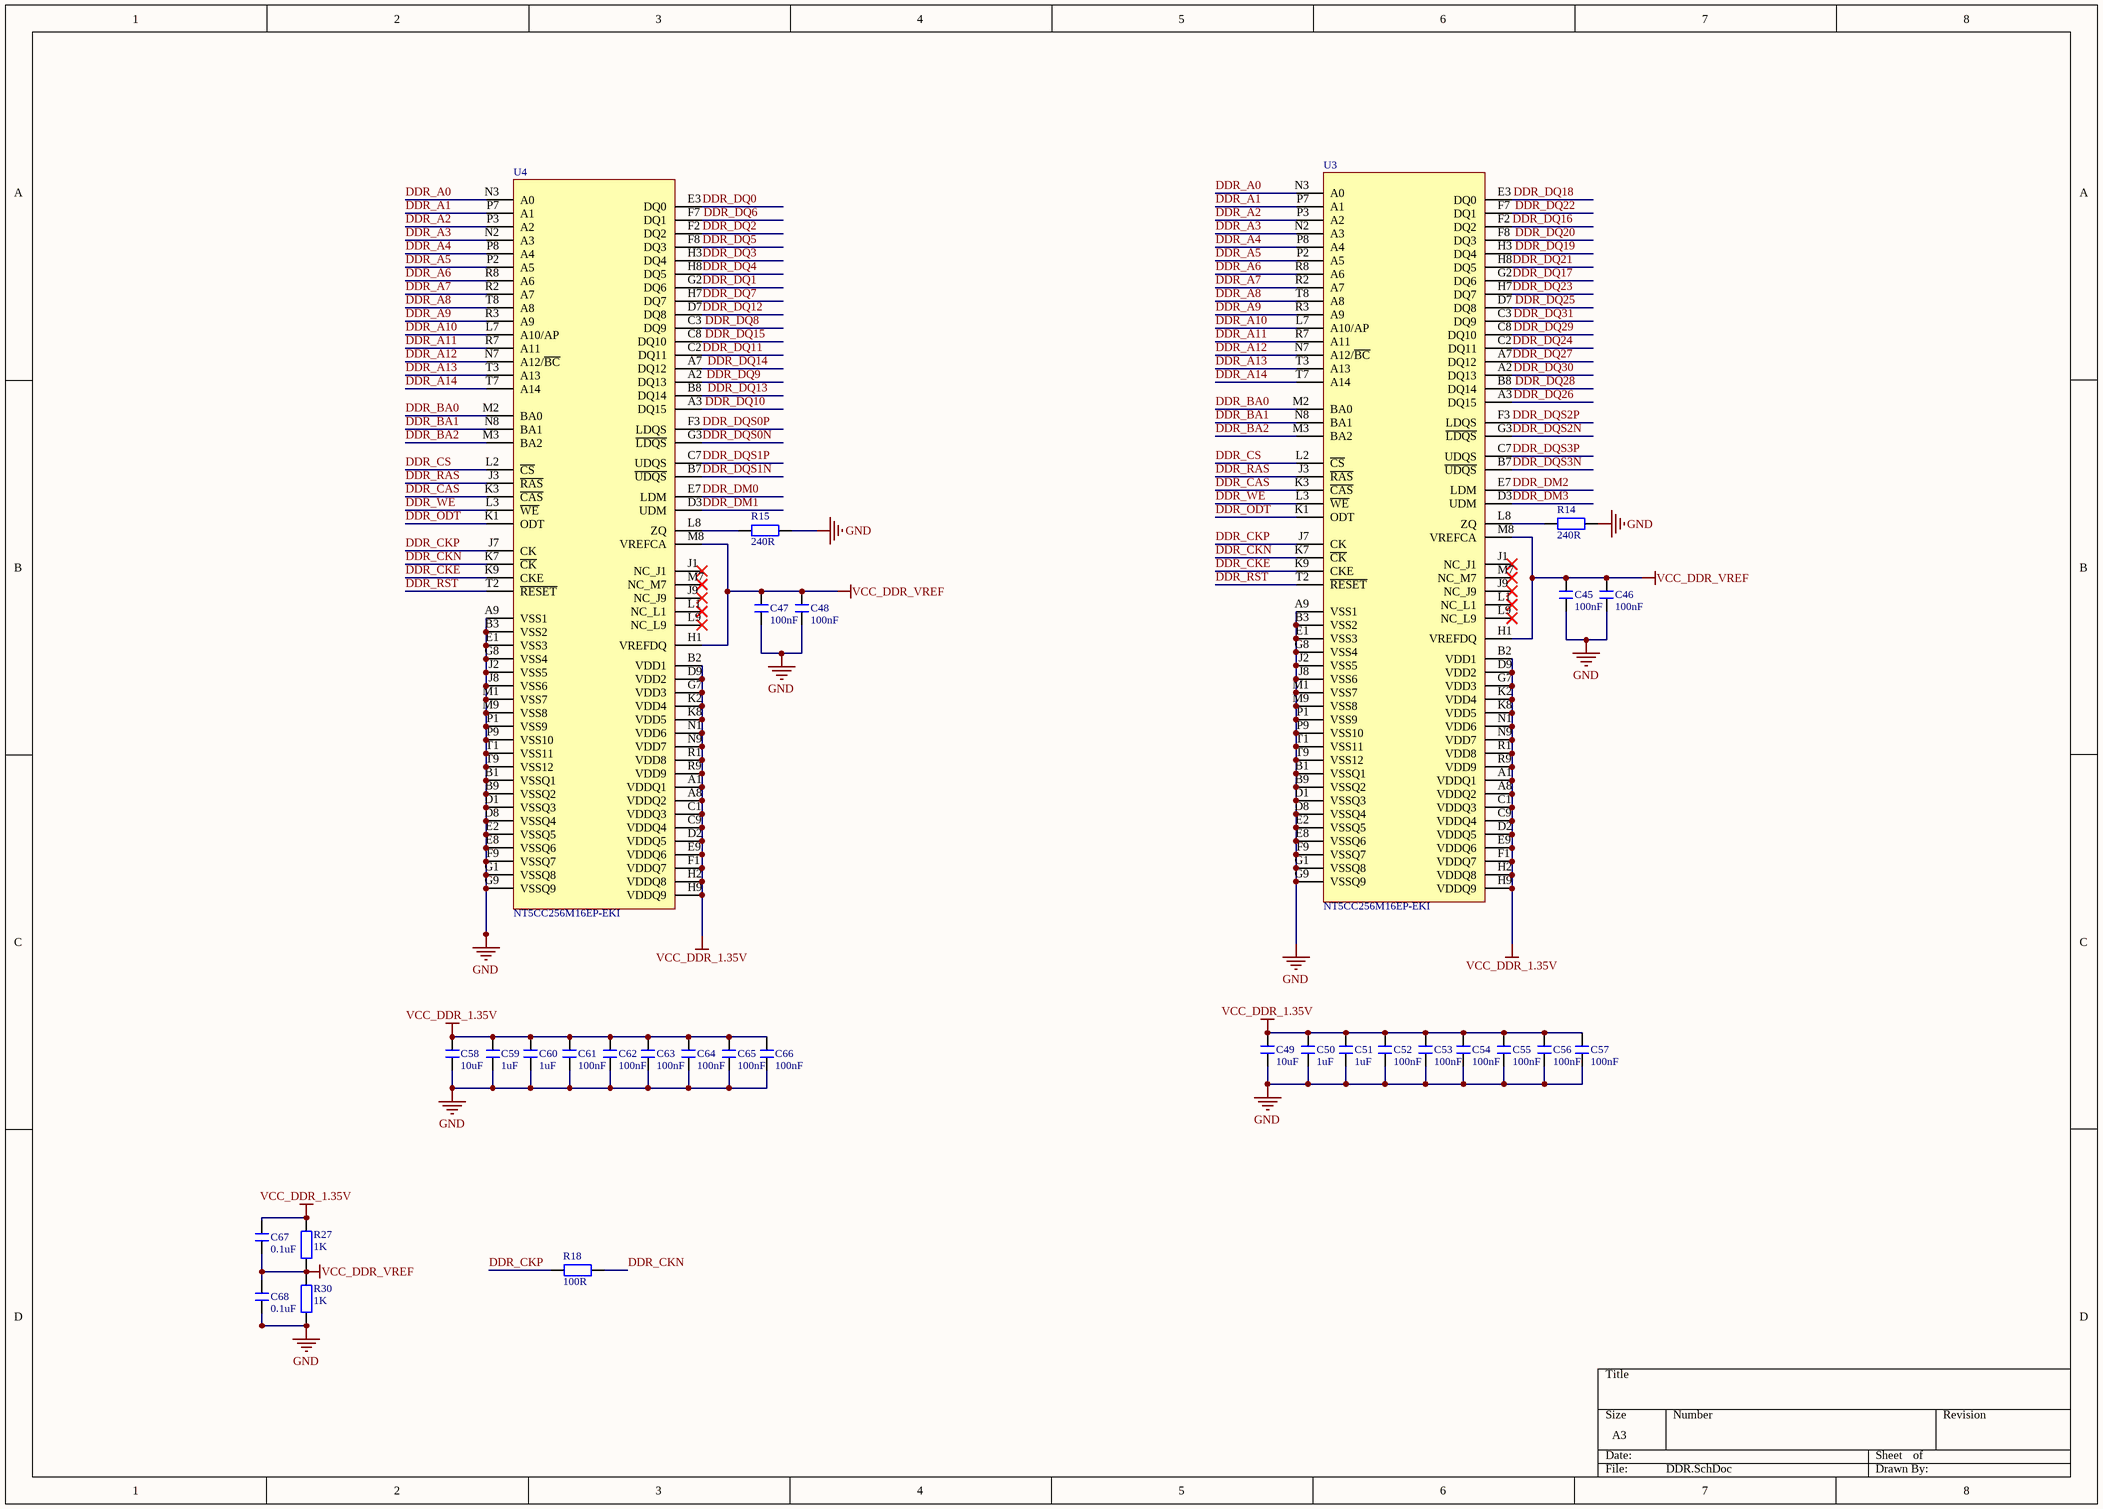
[diagram p5: DDR.SchDoc]

### Parts
C45  100nF  [C 0402]
C46  100nF  [C 0402]
C47  100nF  [C 0402]
C48  100nF  [C 0402]
C49  10uF  [C 0603]
C50  1uF  [C 0402]
C51  1uF  [C 0402]
C52  100nF  [C 0402]
C53  100nF  [C 0402]
C54  100nF  [C 0402]
C55  100nF  [C 0402]
C56  100nF  [C 0402]
C57  100nF  [C 0402]
C58  10uF  [C 0603]
C59  1uF  [C 0402]
C60  1uF  [C 0402]
C61  100nF  [C 0402]
C62  100nF  [C 0402]
C63  100nF  [C 0402]
C64  100nF  [C 0402]
C65  100nF  [C 0402]
C66  100nF  [C 0402]
C67  0.1uF  [C 0402]
C68  0.1uF  [C 0402]
R14  240R  [R 0402]
R15  240R  [R 0402]
R18  100R  [R 0402]
R27  1K  [R 0402]
R30  1K  [R 0402]
U3  NT5CC256M16EP-EKI  [BGA96]
U4  NT5CC256M16EP-EKI  [BGA96]

### Nets
GND: C45.1 C46.1 C47.1 C48.1 C49.1 C50.1 C51.1 C52.1 C53.1 C54.1 C55.1 C56.1 C57.1 C58.1 C59.1 C60.1 C61.1 C62.1 C63.1 C64.1 C65.1 C66.1 C68.1 R14.2 R15.2 R30.1 U3.A9(VSS1) U3.B1(VSSQ1) U3.B3(VSS2) U3.B9(VSSQ2) U3.D1(VSSQ3) U3.D8(VSSQ4) U3.E1(VSS3) U3.E2(VSSQ5) U3.E8(VSSQ6) U3.F9(VSSQ7) U3.G1(VSSQ8) U3.G8(VSS4) U3.G9(VSSQ9) U3.J2(VSS5) U3.J8(VSS6) U3.M1(VSS7) U3.M9(VSS8) U3.P1(VSS9) U3.P9(VSS10) U3.T1(VSS11) U3.T9(VSS12) U4.A9(VSS1) U4.B1(VSSQ1) U4.B3(VSS2) U4.B9(VSSQ2) U4.D1(VSSQ3) U4.D8(VSSQ4) U4.E1(VSS3) U4.E2(VSSQ5) U4.E8(VSSQ6) U4.F9(VSSQ7) U4.G1(VSSQ8) U4.G8(VSS4) U4.G9(VSSQ9) U4.J2(VSS5) U4.J8(VSS6) U4.M1(VSS7) U4.M9(VSS8) U4.P1(VSS9) U4.P9(VSS10) U4.T1(VSS11) U4.T9(VSS12)
VCC_DDR_1.35V: C49.2 C50.2 C51.2 C52.2 C53.2 C54.2 C55.2 C56.2 C57.2 C58.2 C59.2 C60.2 C61.2 C62.2 C63.2 C64.2 C65.2 C66.2 C67.2 R27.2 U3.A1(VDDQ1) U3.A8(VDDQ2) U3.B2(VDD1) U3.C1(VDDQ3) U3.C9(VDDQ4) U3.D2(VDDQ5) U3.D9(VDD2) U3.E9(VDDQ6) U3.F1(VDDQ7) U3.G7(VDD3) U3.H2(VDDQ8) U3.H9(VDDQ9) U3.K2(VDD4) U3.K8(VDD5) U3.N1(VDD6) U3.N9(VDD7) U3.R1(VDD8) U3.R9(VDD9) U4.A1(VDDQ1) U4.A8(VDDQ2) U4.B2(VDD1) U4.C1(VDDQ3) U4.C9(VDDQ4) U4.D2(VDDQ5) U4.D9(VDD2) U4.E9(VDDQ6) U4.F1(VDDQ7) U4.G7(VDD3) U4.H2(VDDQ8) U4.H9(VDDQ9) U4.K2(VDD4) U4.K8(VDD5) U4.N1(VDD6) U4.N9(VDD7) U4.R1(VDD8) U4.R9(VDD9)
VCC_DDR_VREF: C45.2 C46.2 C47.2 C48.2 C67.1 C68.2 R27.1 R30.2 U3.H1(VREFDQ) U3.M8(VREFCA) U4.H1(VREFDQ) U4.M8(VREFCA)
DDR_A0: U3.N3(A0) U4.N3(A0)
DDR_A1: U3.P7(A1) U4.P7(A1)
DDR_A2: U3.P3(A2) U4.P3(A2)
DDR_A3: U3.N2(A3) U4.N2(A3)
DDR_A4: U3.P8(A4) U4.P8(A4)
DDR_A5: U3.P2(A5) U4.P2(A5)
DDR_A6: U3.R8(A6) U4.R8(A6)
DDR_A7: U3.R2(A7) U4.R2(A7)
DDR_A8: U3.T8(A8) U4.T8(A8)
DDR_A9: U3.R3(A9) U4.R3(A9)
DDR_A10: U3.L7(A10/AP) U4.L7(A10/AP)
DDR_A11: U3.R7(A11) U4.R7(A11)
DDR_A12: U3.N7(A12/~{BC}) U4.N7(A12/~{BC})
DDR_A13: U3.T3(A13) U4.T3(A13)
DDR_A14: U3.T7(A14) U4.T7(A14)
DDR_BA0: U3.M2(BA0) U4.M2(BA0)
DDR_BA1: U3.N8(BA1) U4.N8(BA1)
DDR_BA2: U3.M3(BA2) U4.M3(BA2)
DDR_CAS: U3.K3(~{CAS}) U4.K3(~{CAS})
DDR_CKE: U3.K9(CKE) U4.K9(CKE)
DDR_CKN: R18.1 U3.K7(~{CK}) U4.K7(~{CK})
DDR_CKP: R18.2 U3.J7(CK) U4.J7(CK)
DDR_CS: U3.L2(~{CS}) U4.L2(~{CS})
DDR_DM0: U4.E7(LDM)
DDR_DM1: U4.D3(UDM)
DDR_DM2: U3.E7(LDM)
DDR_DM3: U3.D3(UDM)
DDR_DQ0: U4.E3(DQ0)
DDR_DQ1: U4.G2(DQ6)
DDR_DQ2: U4.F2(DQ2)
DDR_DQ3: U4.H3(DQ4)
DDR_DQ4: U4.H8(DQ5)
DDR_DQ5: U4.F8(DQ3)
DDR_DQ6: U4.F7(DQ1)
DDR_DQ7: U4.H7(DQ7)
DDR_DQ8: U4.C3(DQ9)
DDR_DQ9: U4.A2(DQ13)
DDR_DQ10: U4.A3(DQ15)
DDR_DQ11: U4.C2(DQ11)
DDR_DQ12: U4.D7(DQ8)
DDR_DQ13: U4.B8(DQ14)
DDR_DQ14: U4.A7(DQ12)
DDR_DQ15: U4.C8(DQ10)
DDR_DQ16: U3.F2(DQ2)
DDR_DQ17: U3.G2(DQ6)
DDR_DQ18: U3.E3(DQ0)
DDR_DQ19: U3.H3(DQ4)
DDR_DQ20: U3.F8(DQ3)
DDR_DQ21: U3.H8(DQ5)
DDR_DQ22: U3.F7(DQ1)
DDR_DQ23: U3.H7(DQ7)
DDR_DQ24: U3.C2(DQ11)
DDR_DQ25: U3.D7(DQ8)
DDR_DQ26: U3.A3(DQ15)
DDR_DQ27: U3.A7(DQ12)
DDR_DQ28: U3.B8(DQ14)
DDR_DQ29: U3.C8(DQ10)
DDR_DQ30: U3.A2(DQ13)
DDR_DQ31: U3.C3(DQ9)
DDR_DQS0N: U4.G3(~{LDQS})
DDR_DQS0P: U4.F3(LDQS)
DDR_DQS1N: U4.B7(~{UDQS})
DDR_DQS1P: U4.C7(UDQS)
DDR_DQS2N: U3.G3(~{LDQS})
DDR_DQS2P: U3.F3(LDQS)
DDR_DQS3N: U3.B7(~{UDQS})
DDR_DQS3P: U3.C7(UDQS)
DDR_ODT: U3.K1(ODT) U4.K1(ODT)
DDR_RAS: U3.J3(~{RAS}) U4.J3(~{RAS})
DDR_RST: U3.T2(~{RESET}) U4.T2(~{RESET})
DDR_WE: U3.L3(~{WE}) U4.L3(~{WE})
NetR14_1: R14.1 U3.L8(ZQ)
NetR15_1: R15.1 U4.L8(ZQ)

Not connected (* = marked no-connect by the designer): U3 J1(NC_J1)* J9(NC_J9)* L1(NC_L1)* L9(NC_L9)* M7(NC_M7)*; U4 J1(NC_J1)* J9(NC_J9)* L1(NC_L1)* L9(NC_L9)* M7(NC_M7)*

### Library data of the parts
C45-C68 = C: 无极性贴片电容; 版权归属: 正点原子; BOM名称: 无极性贴片电容; 学习资源: www.openedv.com
R14 R15 R18 R27 R30 = R: 贴片电阻; 版权归属: 正点原子; BOM名称: 贴片电阻; 学习资源: www.openedv.com
U3 U4 = MT41K256M16TW

## Sheet EMMC.SchDoc
size A4; SheetNumber: 7; SheetTotal: 8
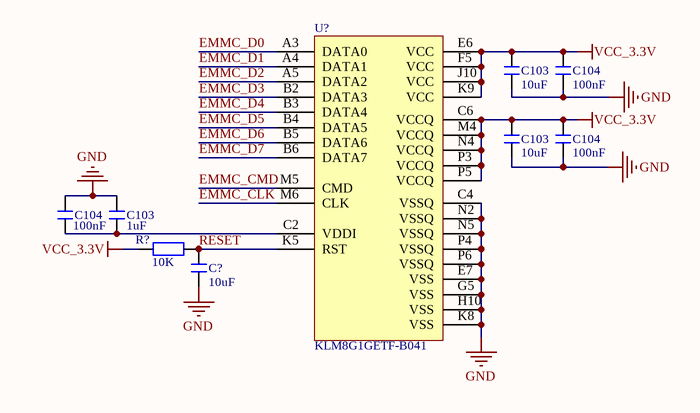
[diagram p6: EMMC.SchDoc]

### Parts
(Parts that share a designator on the sheet are numbered #1, #2 ... from top to bottom, then left to right.)
C103#1  10uF  [C 0603]
C103#2  10uF  [C 0603]
C103#3  1uF  [C 0603]
C104#1  100nF  [C 0402]
C104#2  100nF  [C 0402]
C104#3  100nF  [C 0402]
C?  10uF  [C 0402]
R?  10K  [R 0402]
U?#1  KLM8G1GETF-B041  [BGA153  EMMC]

### Nets
GND: C103#1.1 C103#2.1 C103#3.1 C104#1.1 C104#2.1 C104#3.1 C?.1 U?#1.C4(VSSQ) U?#1.E7(VSS) U?#1.G5(VSS) U?#1.H10(VSS) U?#1.K8(VSS) U?#1.N2(VSSQ) U?#1.N5(VSSQ) U?#1.P4(VSSQ) U?#1.P6(VSSQ)
VCC_3.3V: C103#1.2 C103#2.2 C104#1.2 C104#2.2 R?.1 U?#1.C6(VCCQ) U?#1.E6(VCC) U?#1.F5(VCC) U?#1.J10(VCC) U?#1.K9(VCC) U?#1.M4(VCCQ) U?#1.N4(VCCQ) U?#1.P3(VCCQ) U?#1.P5(VCCQ)
EMMC_CLK: U?#1.M6(CLK)
EMMC_CMD: U?#1.M5(CMD)
EMMC_D0: U?#1.A3(DATA0)
EMMC_D1: U?#1.A4(DATA1)
EMMC_D2: U?#1.A5(DATA2)
EMMC_D3: U?#1.B2(DATA3)
EMMC_D4: U?#1.B3(DATA4)
EMMC_D5: U?#1.B4(DATA5)
EMMC_D6: U?#1.B5(DATA6)
EMMC_D7: U?#1.B6(DATA7)
RESET: C?.2 R?.2 U?#1.K5(RST)
NetC103#3_2: C103#3.2 C104#3.2 U?#1.C2(VDDI)

### Library data of the parts
C103#1-C103#3 C104#1-C104#3 C? = C: 无极性贴片电容; 版权归属: 正点原子; BOM名称: 无极性贴片电容; 学习资源: www.openedv.com
R? = R: 贴片电阻; 版权归属: 正点原子; BOM名称: 贴片电阻; 学习资源: www.openedv.com
U?#1 = KLM8G1GETF-B041: 8GB EMMC存储芯片

## Sheet PHY.SchDoc
size A4; SheetNumber: 8; SheetTotal: 9
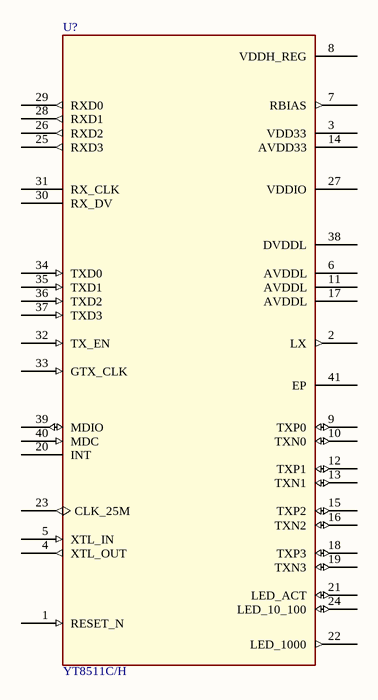
[diagram p7: PHY.SchDoc]

### Parts
(Parts that share a designator on the sheet are numbered #1, #2 ... from top to bottom, then left to right.)
U?#2  YT8511C/H  [QFN40 5X5_N]

### Nets

Not connected (* = marked no-connect by the designer): U?#2 1(RESET_N) 2(LX) 3(VDD33) 4(XTL_OUT) 5(XTL_IN) 6(AVDDL) 7(RBIAS) 8(VDDH_REG) 9(TXP0) 10(TXN0) 11(AVDDL) 12(TXP1) 13(TXN1) 14(AVDD33) 15(TXP2) 16(TXN2) 17(AVDDL) 18(TXP3) 19(TXN3) 20(INT) 21(LED_ACT) 22(LED_1000) 23(CLK_25M) 24(LED_10_100) 25(RXD3) 26(RXD2) 27(VDDIO) 28(RXD1) 29(RXD0) 30(RX_DV) 31(RX_CLK) 32(TX_EN) 33(GTX_CLK) 34(TXD0) 35(TXD1) 36(TXD2) 37(TXD3) 38(DVDDL) 39(MDIO) 40(MDC) 41(EP)

### Library data of the parts
U?#2 = YT8511C/H: 千兆以太网PHY

## Sheet BTB.SchDoc
size A3; SheetNumber: 8; SheetTotal: 8
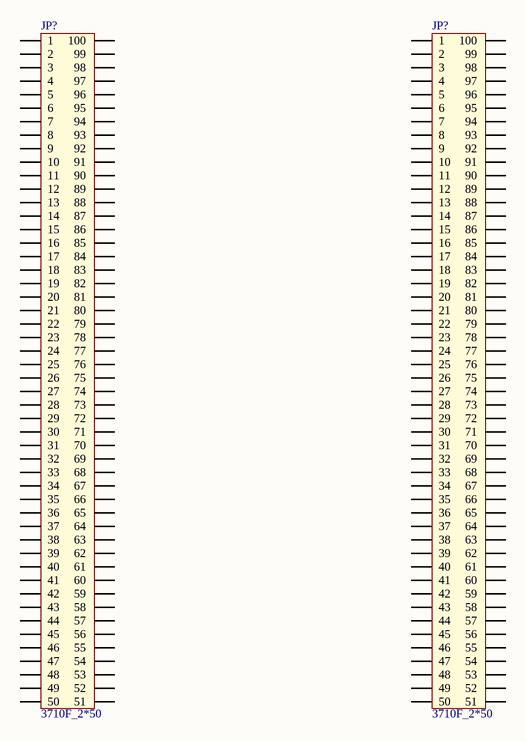
[diagram p8: BTB.SchDoc]

### Parts
(Parts that share a designator on the sheet are numbered #1, #2 ... from top to bottom, then left to right.)
JP?#1  3710F_2*50  [3710F_2*50]
JP?#2  3710F_2*50  [3710F_2*50]

### Nets

Not connected (* = marked no-connect by the designer): JP?#1 1 2 3 4 5 6 7 8 9 10 11 12 13 14 15 16 17 18 19 20 21 22 23 24 25 26 27 28 29 30 31 32 33 34 35 36 37 38 39 40 41 42 43 44 45 46 47 48 49 50 51 52 53 54 55 56 57 58 59 60 61 62 63 64 65 66 67 68 69 70 71 72 73 74 75 76 77 78 79 80 81 82 83 84 85 86 87 88 89 90 91 92 93 94 95 96 97 98 99 100; JP?#2 1 2 3 4 5 6 7 8 9 10 11 12 13 14 15 16 17 18 19 20 21 22 23 24 25 26 27 28 29 30 31 32 33 34 35 36 37 38 39 40 41 42 43 44 45 46 47 48 49 50 51 52 53 54 55 56 57 58 59 60 61 62 63 64 65 66 67 68 69 70 71 72 73 74 75 76 77 78 79 80 81 82 83 84 85 86 87 88 89 90 91 92 93 94 95 96 97 98 99 100

### Library data of the parts
JP?#1 JP?#2 = Header 50x2: 50P*2接插件

## Nets that join several sheets
GND: POWER (29 pins), DDR (68 pins), EMMC (16 pins)
VCC_DDR_1.35V: POWER (5 pins), DDR (56 pins)